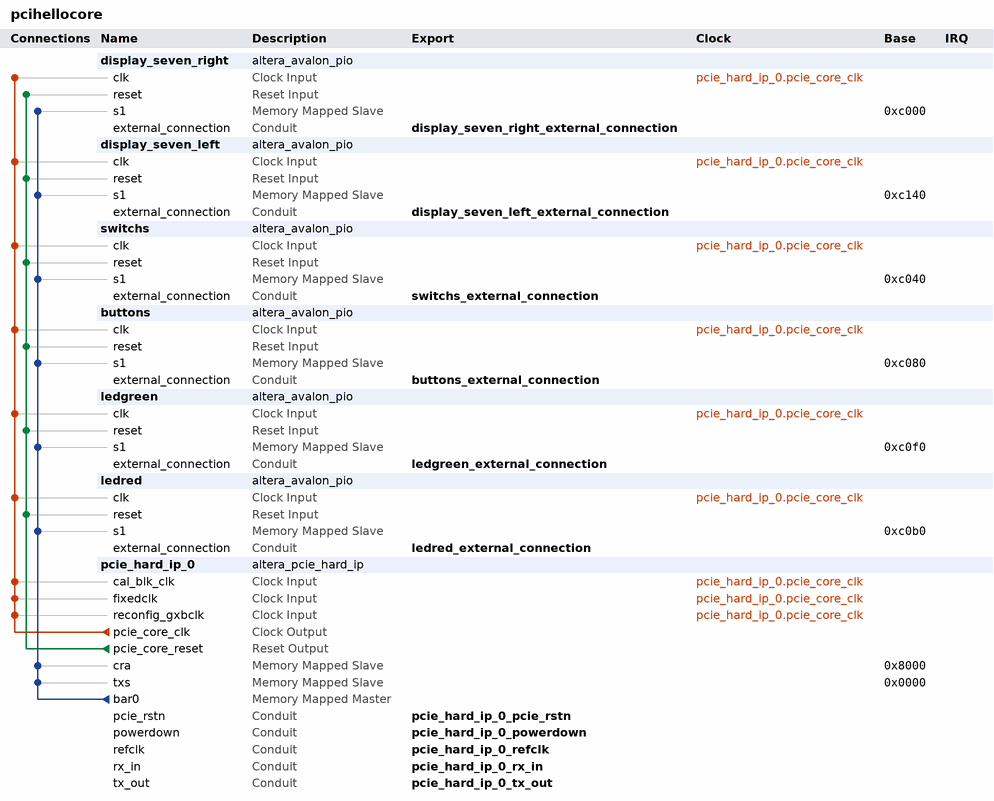
[diagram p0: system contents]
# Platform Designer (Qsys) system pcihellocore, Cyclone IV GX EP4CGX150DF31C7
# Parameters at their usual value, and those the tool derives, are not listed.
package require -exact qsys 17.0
create_system pcihellocore
set_project_property DEVICE_FAMILY {Cyclone IV GX}
set_project_property DEVICE EP4CGX150DF31C7

add_instance display_seven_right altera_avalon_pio 17.0
set_instance_parameter_value display_seven_right direction Output
set_instance_parameter_value display_seven_right resetValue 64
set_instance_parameter_value display_seven_right width 32

add_instance display_seven_left altera_avalon_pio 17.0
set_instance_parameter_value display_seven_left direction Output
set_instance_parameter_value display_seven_left width 32

add_instance switchs altera_avalon_pio 17.0
set_instance_parameter_value switchs direction Input
set_instance_parameter_value switchs width 32

add_instance buttons altera_avalon_pio 17.0
set_instance_parameter_value buttons direction Input
set_instance_parameter_value buttons width 32

add_instance ledgreen altera_avalon_pio 17.0
set_instance_parameter_value ledgreen direction Output
set_instance_parameter_value ledgreen resetValue 170
set_instance_parameter_value ledgreen width 32

add_instance ledred altera_avalon_pio 17.0
set_instance_parameter_value ledred direction Output
set_instance_parameter_value ledred resetValue 170
set_instance_parameter_value ledred width 32

add_instance pcie_hard_ip_0 altera_pcie_hard_ip 17.0
set_instance_parameter_value pcie_hard_ip_0 {BAR Type} {32 bit Non-Prefetchable,Not used,Not used,Not used,Not used,Not used}
set_instance_parameter_value pcie_hard_ip_0 CB_A2P_ADDR_MAP_PASS_THRU_BITS 15
set_instance_parameter_value pcie_hard_ip_0 CG_ENABLE_A2P_INTERRUPT 0
set_instance_parameter_value pcie_hard_ip_0 CG_NO_CPL_REORDERING 0
set_instance_parameter_value pcie_hard_ip_0 {PCIe Address 31:0} 0x00000000,0x00000000,0x00000000,0x00000000,0x00000000,0x00000000,0x00000000,0x00000000,0x00000000,0x00000000,0x00000000,0x00000000,0x00000000,0x00000000,0x00000000,0x00000000
set_instance_parameter_value pcie_hard_ip_0 {PCIe Address 63:32} 0x00000000,0x00000000,0x00000000,0x00000000,0x00000000,0x00000000,0x00000000,0x00000000,0x00000000,0x00000000,0x00000000,0x00000000,0x00000000,0x00000000,0x00000000,0x00000000
set_instance_parameter_value pcie_hard_ip_0 class_code 0
set_instance_parameter_value pcie_hard_ip_0 device_id 4
set_instance_parameter_value pcie_hard_ip_0 my_advanced_errors false
set_instance_parameter_value pcie_hard_ip_0 my_enable_ecrc_check false
set_instance_parameter_value pcie_hard_ip_0 my_enable_ecrc_gen false
set_instance_parameter_value pcie_hard_ip_0 p_pcie_test_out_width None
set_instance_parameter_value pcie_hard_ip_0 p_user_msi_enable 0
set_instance_parameter_value pcie_hard_ip_0 subsystem_device_id 4
set_instance_parameter_value pcie_hard_ip_0 subsystem_vendor_id 4466
set_instance_parameter_value pcie_hard_ip_0 vendor_id 4466

# connections
add_connection pcie_hard_ip_0.pcie_core_clk buttons.clk clock
add_connection pcie_hard_ip_0.pcie_core_clk display_seven_left.clk clock
add_connection pcie_hard_ip_0.pcie_core_clk display_seven_right.clk clock
add_connection pcie_hard_ip_0.pcie_core_clk ledgreen.clk clock
add_connection pcie_hard_ip_0.pcie_core_clk ledred.clk clock
add_connection pcie_hard_ip_0.pcie_core_clk pcie_hard_ip_0.cal_blk_clk clock
add_connection pcie_hard_ip_0.pcie_core_clk pcie_hard_ip_0.fixedclk clock
add_connection pcie_hard_ip_0.pcie_core_clk pcie_hard_ip_0.reconfig_gxbclk clock
add_connection pcie_hard_ip_0.pcie_core_clk switchs.clk clock
add_connection pcie_hard_ip_0.pcie_core_reset buttons.reset reset
add_connection pcie_hard_ip_0.pcie_core_reset display_seven_left.reset reset
add_connection pcie_hard_ip_0.pcie_core_reset display_seven_right.reset reset
add_connection pcie_hard_ip_0.pcie_core_reset ledgreen.reset reset
add_connection pcie_hard_ip_0.pcie_core_reset ledred.reset reset
add_connection pcie_hard_ip_0.pcie_core_reset switchs.reset reset
add_connection pcie_hard_ip_0.bar0 buttons.s1 avalon
set_connection_parameter_value pcie_hard_ip_0.bar0/buttons.s1 baseAddress 0xc080
add_connection pcie_hard_ip_0.bar0 display_seven_left.s1 avalon
set_connection_parameter_value pcie_hard_ip_0.bar0/display_seven_left.s1 baseAddress 0xc140
add_connection pcie_hard_ip_0.bar0 display_seven_right.s1 avalon
set_connection_parameter_value pcie_hard_ip_0.bar0/display_seven_right.s1 baseAddress 0xc000
add_connection pcie_hard_ip_0.bar0 ledgreen.s1 avalon
set_connection_parameter_value pcie_hard_ip_0.bar0/ledgreen.s1 baseAddress 0xc0f0
add_connection pcie_hard_ip_0.bar0 ledred.s1 avalon
set_connection_parameter_value pcie_hard_ip_0.bar0/ledred.s1 baseAddress 0xc0b0
add_connection pcie_hard_ip_0.bar0 pcie_hard_ip_0.cra avalon
set_connection_parameter_value pcie_hard_ip_0.bar0/pcie_hard_ip_0.cra baseAddress 0x8000
add_connection pcie_hard_ip_0.bar0 pcie_hard_ip_0.txs avalon
set_connection_parameter_value pcie_hard_ip_0.bar0/pcie_hard_ip_0.txs baseAddress 0x0000
add_connection pcie_hard_ip_0.bar0 switchs.s1 avalon
set_connection_parameter_value pcie_hard_ip_0.bar0/switchs.s1 baseAddress 0xc040

# exported interfaces
add_interface buttons_external_connection conduit end
set_interface_property buttons_external_connection EXPORT_OF buttons.external_connection
add_interface display_seven_left_external_connection conduit end
set_interface_property display_seven_left_external_connection EXPORT_OF display_seven_left.external_connection
add_interface display_seven_right_external_connection conduit end
set_interface_property display_seven_right_external_connection EXPORT_OF display_seven_right.external_connection
add_interface ledgreen_external_connection conduit end
set_interface_property ledgreen_external_connection EXPORT_OF ledgreen.external_connection
add_interface ledred_external_connection conduit end
set_interface_property ledred_external_connection EXPORT_OF ledred.external_connection
add_interface pcie_hard_ip_0_pcie_rstn conduit end
set_interface_property pcie_hard_ip_0_pcie_rstn EXPORT_OF pcie_hard_ip_0.pcie_rstn
add_interface pcie_hard_ip_0_powerdown conduit end
set_interface_property pcie_hard_ip_0_powerdown EXPORT_OF pcie_hard_ip_0.powerdown
add_interface pcie_hard_ip_0_refclk conduit end
set_interface_property pcie_hard_ip_0_refclk EXPORT_OF pcie_hard_ip_0.refclk
add_interface pcie_hard_ip_0_rx_in conduit end
set_interface_property pcie_hard_ip_0_rx_in EXPORT_OF pcie_hard_ip_0.rx_in
add_interface pcie_hard_ip_0_tx_out conduit end
set_interface_property pcie_hard_ip_0_tx_out EXPORT_OF pcie_hard_ip_0.tx_out
add_interface switchs_external_connection conduit end
set_interface_property switchs_external_connection EXPORT_OF switchs.external_connection

set_interconnect_requirement {$system} qsys_mm.clockCrossingAdapter HANDSHAKE
set_interconnect_requirement {$system} qsys_mm.maxAdditionalLatency 1

save_system pcihellocore.qsys
